# EAGLE design BPF (EAGLE 9.6.2)
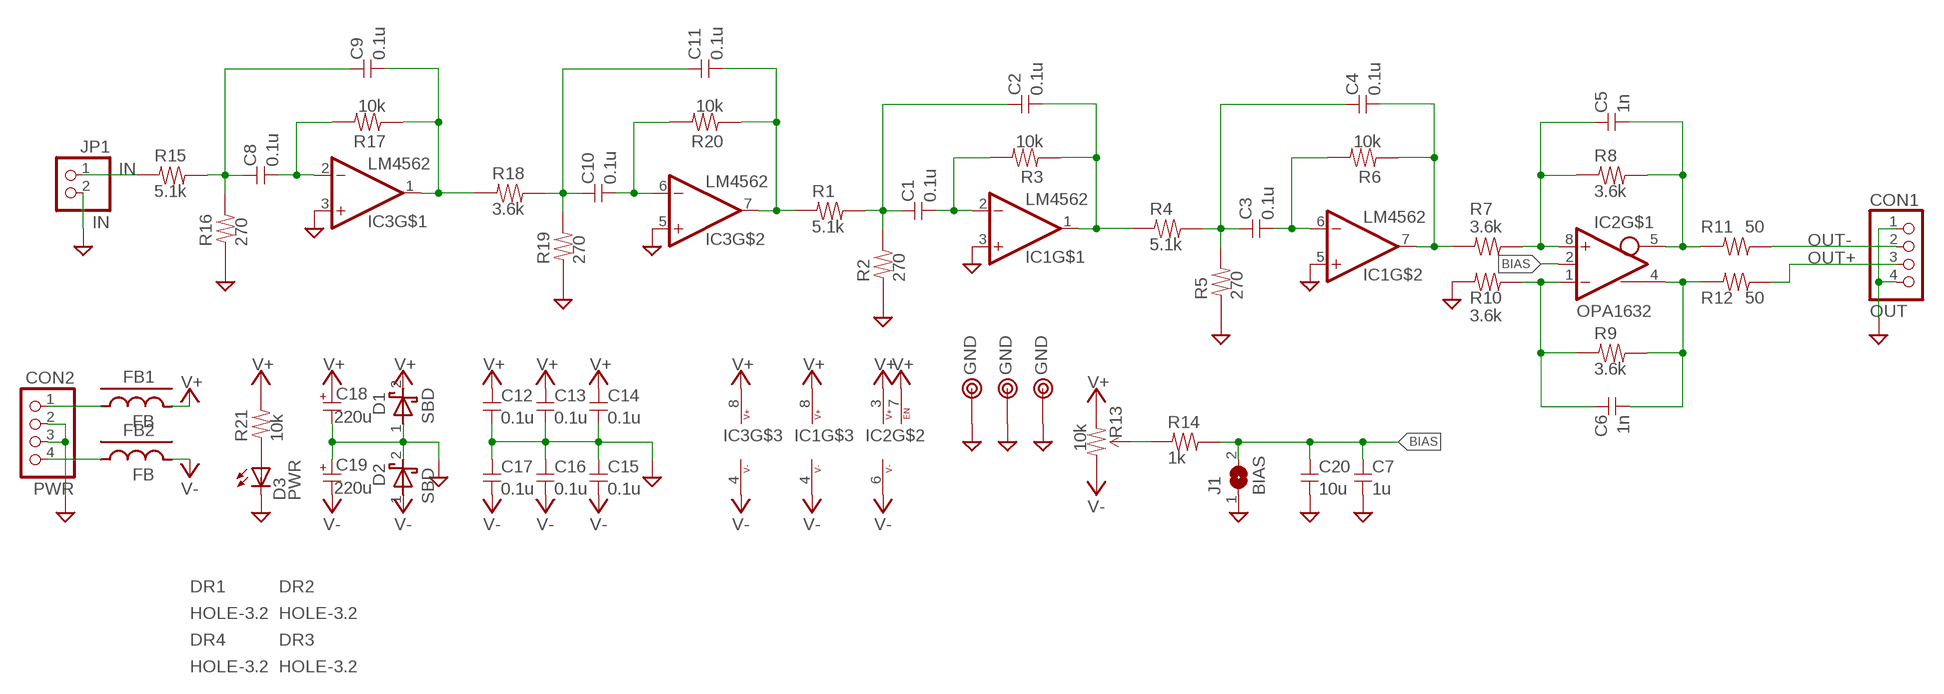
[diagram p0: schematic, sheet 1]

## Parts
C1  0.1u  C-5W  [C050W]
C2  0.1u  C-5W  [C050W]
C3  0.1u  C-5W  [C050W]
C4  0.1u  C-5W  [C050W]
C5  1n  C-2012  [2012]
C6  1n  C-2012  [2012]
C7  1u  C-1608  [1608C]
C8  0.1u  C-5W  [C050W]
C9  0.1u  C-5W  [C050W]
C10  0.1u  C-5W  [C050W]
C11  0.1u  C-5W  [C050W]
C12  0.1u  C-1608  [1608C]
C13  0.1u  C-1608  [1608C]
C14  0.1u  C-1608  [1608C]
C15  0.1u  C-1608  [1608C]
C16  0.1u  C-1608  [1608C]
C17  0.1u  C-1608  [1608C]
C18  220u  CPOLE2.5-8  [E2,5-8]
C19  220u  CPOLE2.5-8  [E2,5-8]
C20  10u  C-3216  [3216]
CON1  OUT  PINHD-1X4-N  [1X04]
CON2  PWR  PINHD-1X4-N  [1X04]
D1  SBD  SBD-1A2  [SOD123]
D2  SBD  SBD-1A2  [SOD123]
D3  PWR  LED-SMD1608  [D1608]
DR1  HOLE-3.2  [HOLE_3.2]
DR2  HOLE-3.2  [HOLE_3.2]
DR3  HOLE-3.2  [HOLE_3.2]
DR4  HOLE-3.2  [HOLE_3.2]
FB1  FB  FB-2012-FB  [2012-R]
FB2  FB  FB-2012-FB  [2012-R]
IC1  LM4562  OPA-2-SOP  [SOP8]
IC2  OPA1632  OPA-DIFF  [SOP8]
IC3  LM4562  OPA-2-SOP  [SOP8]
J1  BIAS  SJ-1608  [1608-J]
JP1  IN  PINHD-1X2  [1X02]
R1  5.1k  R-2012  [2012]
R2  270  R-2012  [2012]
R3  10k  R-2012  [2012]
R4  5.1k  R-2012  [2012]
R5  270  R-2012  [2012]
R6  10k  R-2012  [2012]
R7  3.6k  R-2012  [2012]
R8  3.6k  R-2012  [2012]
R9  3.6k  R-2012  [2012]
R10  3.6k  R-2012  [2012]
R11  50  R-1608  [1608]
R12  50  R-1608  [1608]
R13  10k  R-VAL-3296W  [3296W]
R14  1k  R-1608  [1608]
R15  5.1k  R-2012  [2012]
R16  270  R-2012  [2012]
R17  10k  R-2012  [2012]
R18  3.6k  R-2012  [2012]
R19  270  R-2012  [2012]
R20  10k  R-2012  [2012]
R21  10k  R-1608  [1608]
TP1  GND  TESTPIN  [TESTPIN]
TP2  GND  TESTPIN  [TESTPIN]
TP3  GND  TESTPIN  [TESTPIN]

## Nets
BIAS: C7.1 C20.1 IC2.2(CM) J1.2 R14.2
GND: C7.2 C12.2 C13.2 C14.2 C15.1 C16.1 C17.1 C18.- C19.+ C20.2 CON1.1 CON1.4 CON2.2 CON2.3 D1.1(A) D2.2(K) D3.K IC1.3(+IN) IC1.5(+IN) IC3.3(+IN) IC3.5(+IN) J1.1 JP1.2 R2.1 R5.1 R10.1 R16.1 R19.1 TP1.1 TP2.1 TP3.1
IN: JP1.1 R15.1
N$1: C1.1 C1.3 C2.1 C2.3 R1.2 R2.2
N$2: C1.2 C1.4 IC1.2(-IN) R3.2
N$3: C2.2 C2.4 IC1.1(OUT) R3.1 R4.1
N$4: C4.2 C4.4 IC1.7(OUT) R6.1 R7.1
N$5: C3.1 C3.3 C4.1 C4.3 R4.2 R5.2
N$6: C3.2 C3.4 IC1.6(-IN) R6.2
N$7: CON2.1 FB1.1
N$8: C5.1 IC2.8(+IN) R7.2 R8.1
N$9: C6.1 IC2.1(-IN) R9.1 R10.2
N$10: C8.1 C8.3 C9.1 C9.3 R15.2 R16.2
N$11: C5.2 IC2.5(-OUT) R8.2 R11.1
N$12: C6.2 IC2.4(+OUT) R9.2 R12.1
N$13: C8.2 C8.4 IC3.2(-IN) R17.2
N$14: R13.2 R14.1
N$15: C9.2 C9.4 IC3.1(OUT) R17.1 R18.1
N$16: C11.2 C11.4 IC3.7(OUT) R1.1 R20.1
N$17: C10.1 C10.3 C11.1 C11.3 R18.2 R19.2
N$18: C10.2 C10.4 IC3.6(-IN) R20.2
N$19: CON2.4 FB2.1
N$20: D3.A R21.1
OUT+: CON1.3 R12.2
OUT-: CON1.2 R11.2
V+: C12.1 C13.1 C14.1 C18.+ D1.2(K) FB1.2 IC1.8(V+) IC2.3(V+) IC2.7(EN) IC3.8(V+) R13.1 R21.2
V-: C15.2 C16.2 C17.2 C19.- D2.1(A) FB2.2 IC1.4(V-) IC2.6(V-) IC3.4(V-) R13.3

## Library data of the parts
C1-C17 C20 = my_rcl:C
C18 C19 = my_rcl:CPOL
CON1 CON2 = my_connector:PINHD-1X4
D1 D2 = my_rcl:SBD
D3 = my_rcl:LED
DR1-DR4 = my_connector:HOLE-3.2
FB1 FB2 = my_rcl:FB
IC1 IC3 = my_ic:OPA-2
IC2 = my_ic:OPA-DIFF
J1 = my_rcl:SJ
JP1 = my_connector:PINHD-1X2
R1-R12 R14-R21 = my_rcl:R
R13 = my_rcl:R-VAL
TP1-TP3 = my_connector:TESTPIN

## Board
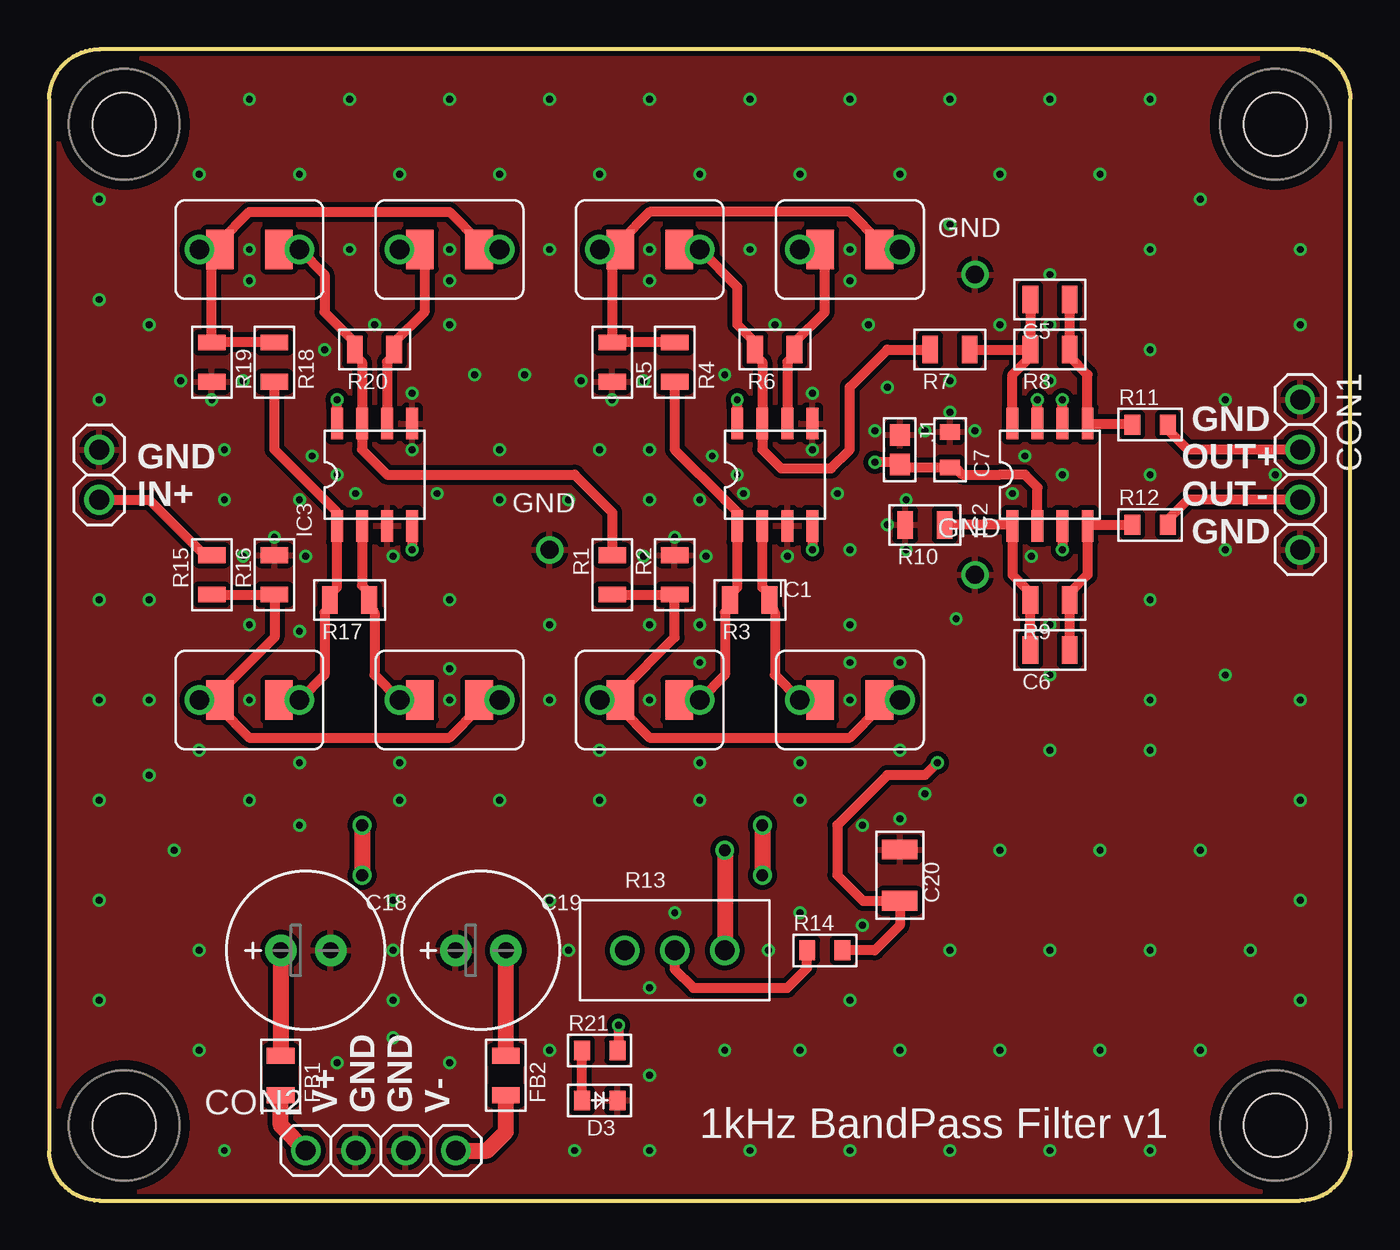
[diagram p1: board, top side]
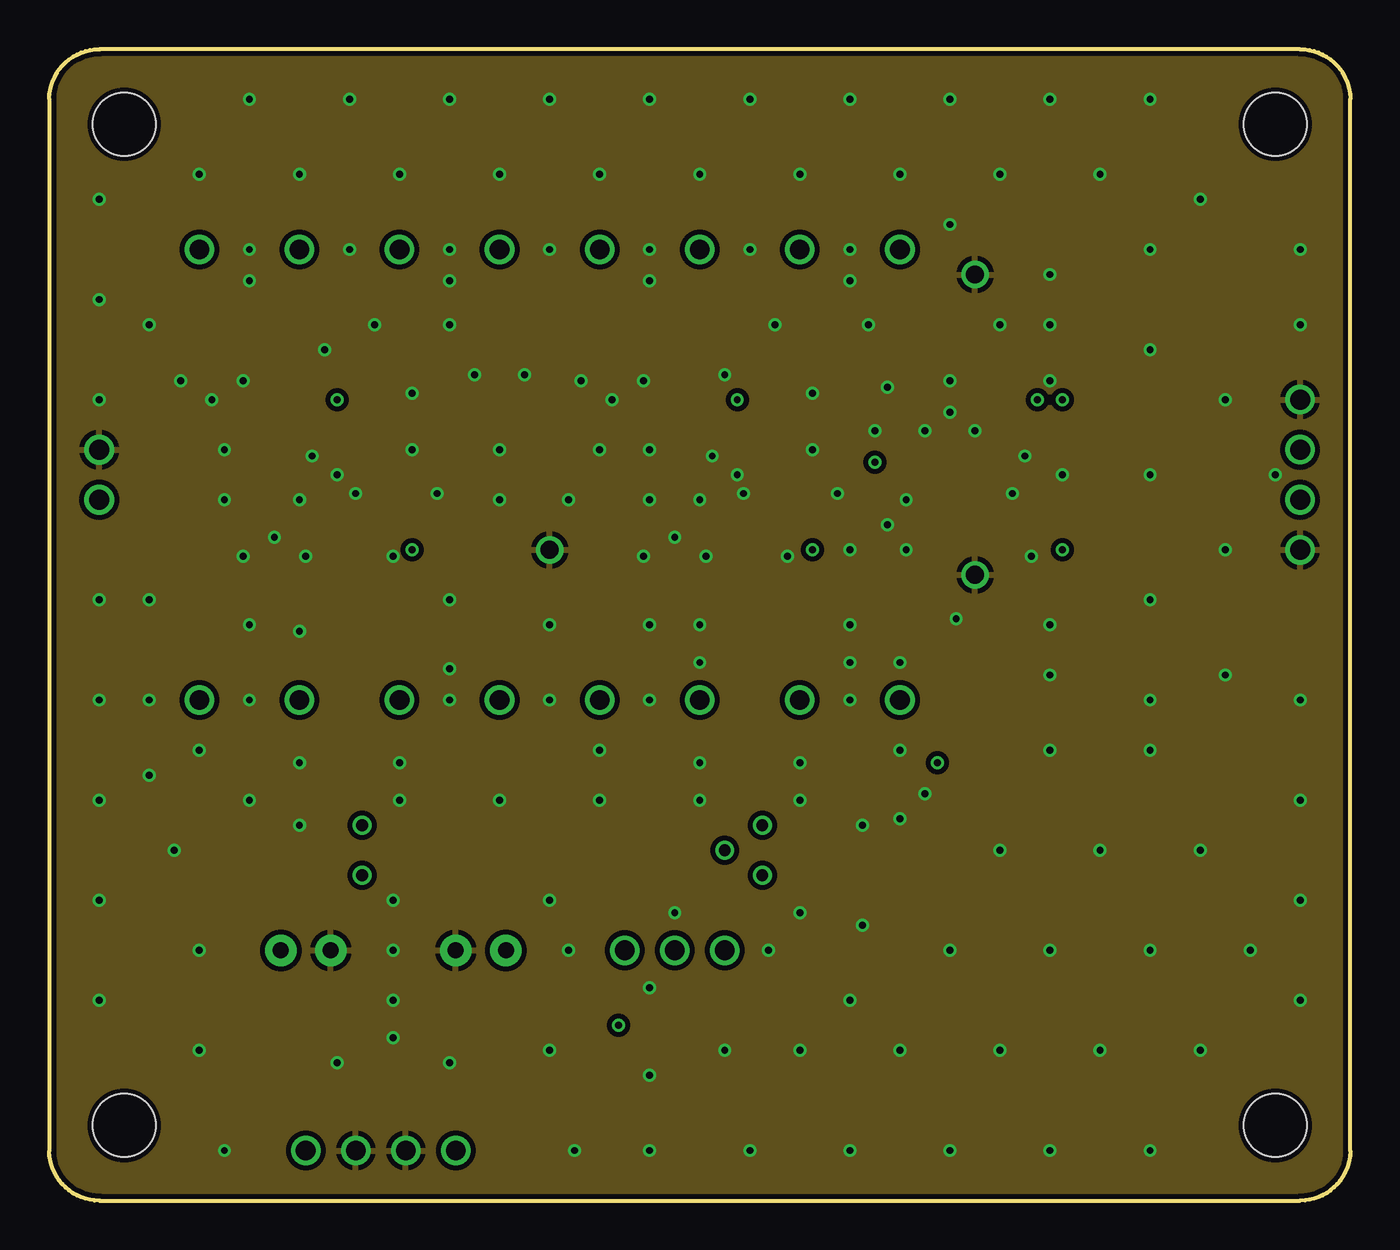
[diagram p2: board, inner layer Route2]
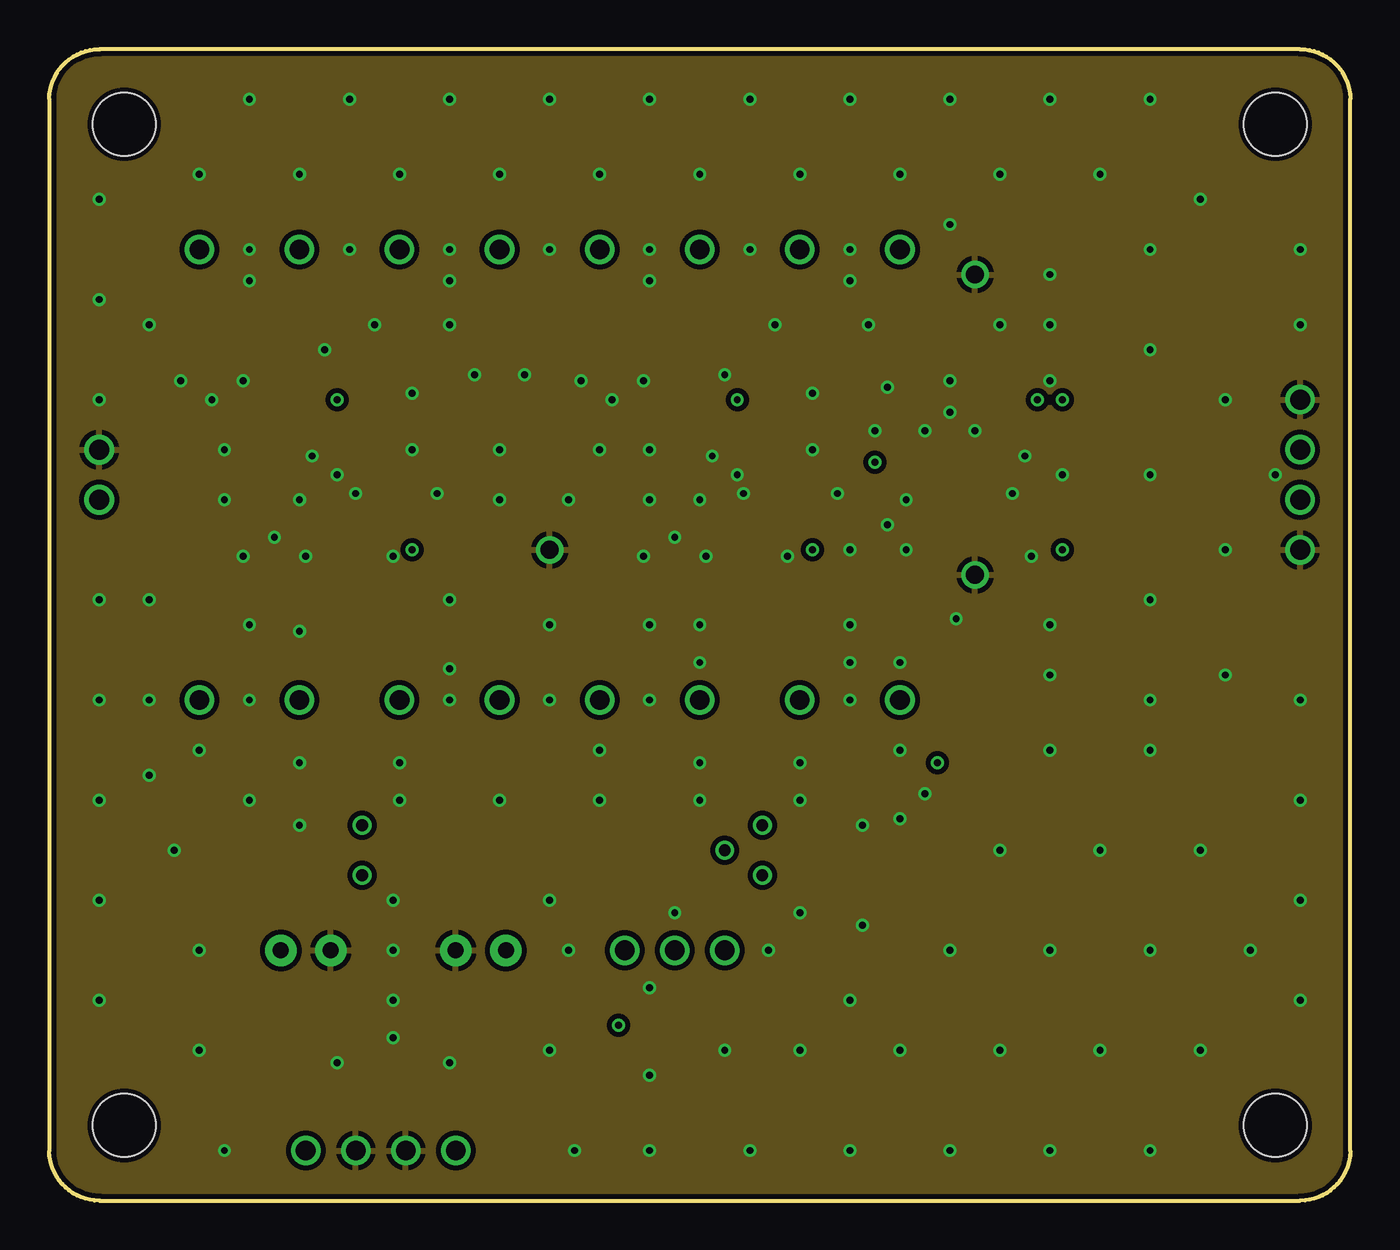
[diagram p3: board, inner layer Route15]
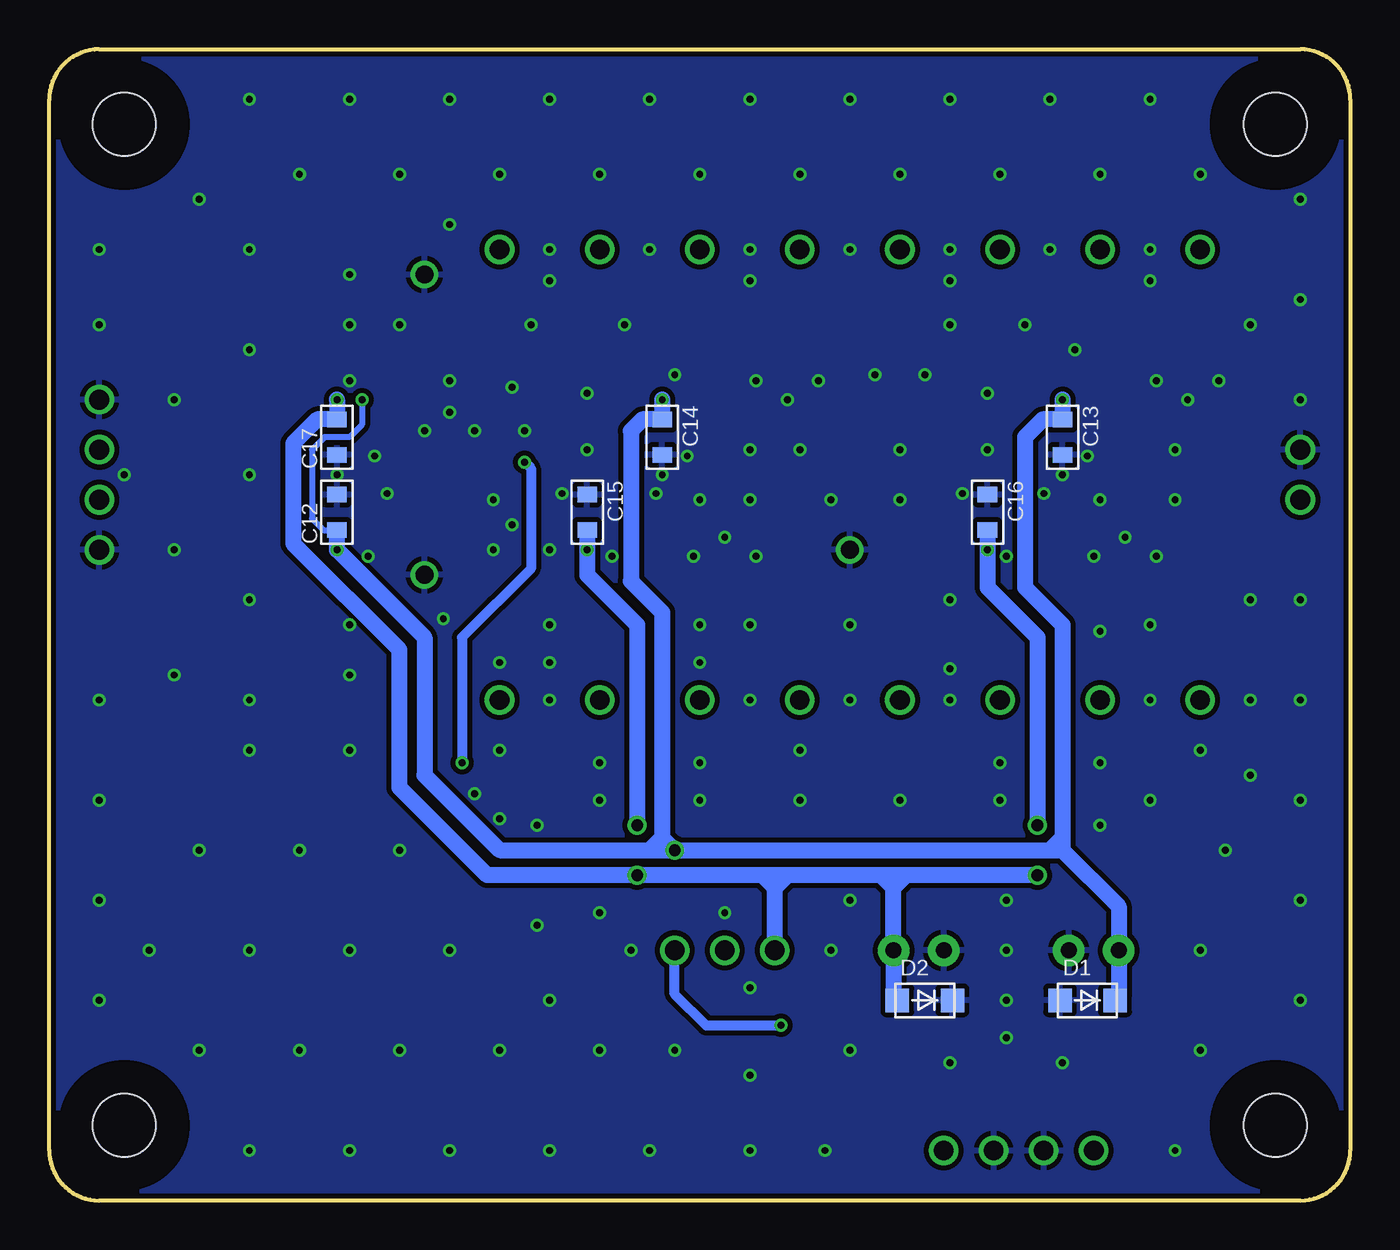
[diagram p4: board, bottom side, seen from below]

Size 66.04 x 58.42 mm. Coordinates in mm from the lower left corner, seen from the top.
Outline: 2.54,0 63.5,0 arc90 66.04,2.54 66.04,55.88 arc90 63.5,58.42 2.54,58.42 arc90 0,55.88 0,2.54 arc90 2.54,0
Copper layers (1*2*15*16): Top 0.035mm / dielectric 0.2mm / Route2 0.0175mm / dielectric 1.065mm / Route15 0.0175mm / dielectric 0.2mm / Bottom 0.035mm
Design rules "JLCPCB_4layer": minimum track width 6mil, minimum drill 0.3mm, track to track 6mil, track to pad 6mil, pad to pad 6mil, via to via 8mil, smd to smd 0mil, copper to edge 0.2mm, drill to drill 0.4mm, minimum pad ring 8mil, minimum via ring 6mil, stop-mask expansion 4mil, vias tented up to drill 1mm, thermal gap 10mil

### Footprints (pad centres in the part's own frame; a part is rotated, then mirrored left to right if it is on the bottom)
C050W = drill 1: 1 -2.54,0; 2 2.54,0 | smd 1.4 x 2: 3 -1.5,0; 4 1.5,0
2012 = smd 0.8 x 1.4: 1 -1,0; 2 1,0
1608C = smd 0.8 x 1: 1 -0.9,0; 2 0.9,0
E2,5-8 = drill 0.813 pad 1.6: + -1.27,0; - 1.27,0
3216 = smd 1 x 1.8: 1 -1.3,0; 2 1.3,0
1X04 = drill 1: 1 -3.81,0; 2 -1.27,0; 3 1.27,0; 4 3.81,0
SOD123 = smd 1.2 x 1.2: 1 -1.4,0; 2 1.4,0
D1608 = smd 0.8 x 1: A 0.9,0; K -0.9,0
HOLE_3.2 = hole 3.2: 0,0
2012-R = smd 0.8 x 1.4: 1 -1,0; 2 1,0
SOP8 = smd 0.6 x 1.6: 1 -1.905,-2.6; 2 -0.635,-2.6; 3 0.635,-2.6; 4 1.905,-2.6; 5 1.905,2.6; 6 0.635,2.6; 7 -0.635,2.6; 8 -1.905,2.6
1608-J = smd 1.1 x 1: 1 -0.75,0; 2 0.75,0
1X02 = drill 1.016: 1 -1.27,0; 2 1.27,0
1608 = smd 0.8 x 1: 1 -0.9,0; 2 0.9,0
3296W = drill 1: 1 2.54,0; 2 0,0; 3 -2.54,0
TESTPIN = drill 0.9 pad 1.4: 1 0,0

### Placement (x,y rotation side)
C1  40.64,25.4 180 top
C2  30.48,25.4 0 top
C3  40.64,48.26 180 top
C4  30.48,48.26 0 top
C5  50.8,45.72 0 top
C6  50.8,27.94 0 top
C7  45.72,38.1 90 top
C8  20.32,25.4 180 top
C9  10.16,25.4 0 top
C10  20.32,48.26 180 top
C11  10.16,48.26 0 top
C12  51.44,34.93 90 bottom
C13  14.61,38.73 270 bottom
C14  34.92,38.73 270 bottom
C15  38.73,34.93 270 bottom
C16  18.41,34.93 270 bottom
C17  51.44,38.73 90 bottom
C18  13.02,12.7 0 top
C19  21.91,12.7 0 top
C20  43.18,16.51 90 top
CON1  63.5,36.83 270 top
CON2  16.83,2.54 0 top
D1  13.34,10.16 0 bottom
D2  21.59,10.16 0 bottom
D3  27.94,5.08 180 top
DR1  3.81,3.81 0 top
DR2  3.81,54.61 0 top
DR3  62.23,3.81 0 top
DR4  62.23,54.61 0 top
FB1  11.75,6.35 90 top
FB2  23.18,6.35 90 top
IC1  36.83,36.83 0 top
IC2  50.8,36.83 0 top
IC3  16.51,36.83 0 top
J1  43.18,38.1 270 top
JP1  2.54,36.83 90 top
R1  28.58,31.75 270 top
R2  31.75,31.75 270 top
R3  35.56,30.48 0 top
R4  31.75,42.55 90 top
R5  28.58,42.55 90 top
R6  36.83,43.18 0 top
R7  45.72,43.18 0 top
R8  50.8,43.18 0 top
R9  50.8,30.48 0 top
R10  44.45,34.29 0 top
R11  55.88,39.37 0 top
R12  55.88,34.29 0 top
R13  31.75,12.7 0 top
R14  39.37,12.7 0 top
R15  8.26,31.75 270 top
R16  11.43,31.75 270 top
R17  15.24,30.48 0 top
R18  11.43,42.55 90 top
R19  8.26,42.55 90 top
R20  16.51,43.18 0 top
R21  27.94,7.62 0 top
TP1  25.4,33.02 0 top
TP2  46.99,46.99 0 top
TP3  46.99,31.75 0 top

### Tracks (layer width: path | path; a pad name or v marks a point on that pad's centre or on a via)
BIAS  (via drill 0.35)
  Top 0.508: IC2.2 50.16,36.2 49.53,36.83 48.26,36.83 46.36,36.83 45.98,37.2 C7.1 43.33,37.2 J1.2 43.06,37.47 v41.91,37.47 | v45.09,22.23 44.45,21.59 42.55,21.59 40,19.05 40,16.51 41.3,15.21 C20.1 43.18,13.97 41.91,12.7 R14.2
  Bottom 0.508: v41.91,37.47 41.59,37.15 41.59,32.07 45.09,28.58 v45.09,22.23
GND  (via drill 0.35)
  other vias: 14.61,36.83 18.41,38.1 18.41,40.96 17.46,32.7 19.68,35.88 40,35.88 37.47,32.7 38.73,40.96 38.73,38.1 35.24,35.88 43.5,35.56 43.5,33.02 40.64,33.02 40.64,29.21 43.18,22.86 43.18,19.37 41.27,19.05 38.1,20.32 33.02,20.32 27.94,20.32 22.86,20.32 17.78,20.32 25.4,25.4 20.32,30.48 2.54,50.8 2.54,45.72 2.54,40.64 2.54,30.48 2.54,25.4 2.54,20.32 2.54,15.24 2.54,10.16 7.62,7.62 8.89,2.54 26.67,2.54 30.48,2.54 35.56,2.54 40.64,2.54 45.72,2.54 50.8,2.54 55.88,2.54 58.42,7.62 63.5,10.16 63.5,15.24 63.5,20.32 63.5,25.4 63.5,44.45 63.5,48.26 58.42,50.8 55.88,55.88 50.8,55.88 45.72,55.88 40.64,55.88 35.56,55.88 30.48,55.88 25.4,55.88 20.32,55.88 15.24,55.88 10.16,55.88 7.62,52.07 9.84,41.59 8.26,40.64 6.67,41.59 9.84,32.7 13.02,32.7 11.43,33.66 30.16,32.7 33.34,32.7 31.75,33.66 26.99,41.59 30.16,41.59 28.58,40.64 42.55,34.29 46.04,29.53 43.18,27.3 33.66,37.78 13.34,37.78 15.56,35.88 34.92,36.83 22.86,38.1 27.94,38.1 22.86,35.56 26.35,35.56 30.48,35.56 41.91,39.05 44.45,39.05 46.99,39.05 45.72,40.01 50.8,41.59 50.8,44.45 50.8,46.99 50.8,29.21 50.8,26.67 49.85,32.7 59.69,33.02 59.69,40.64 55.88,36.83 62.23,36.83 55.88,30.48 55.88,43.18 55.88,25.4 55.88,48.26 50.8,22.86 48.26,17.78 38.1,14.61 31.75,14.61 25.4,15.24 30.48,6.35 25.4,7.62 38.1,7.62 43.18,7.62 48.26,7.62 53.34,7.62 45.72,12.7 50.8,12.7 55.88,12.7 60.96,12.7 53.34,17.78 58.42,17.78 55.88,22.86 59.69,26.67 7.62,12.7 6.35,17.78 10.16,20.32 12.7,19.05 5.08,25.4 5.08,21.59 5.08,30.48 8.89,35.56 5.08,44.45 13.97,43.18 8.89,38.1 10.16,46.67 15.24,48.26 16.51,44.45 12.7,52.07 17.78,52.07 22.86,52.07 27.94,52.07 33.02,52.07 38.1,52.07 43.18,52.07 48.26,52.07 53.34,52.07 45.72,49.53 41.59,44.45 40.64,46.67 30.48,46.67 20.32,46.67 20.32,26.99 40.64,25.4 30.48,25.4 20.32,25.4 10.16,25.4 40.64,27.3 33.02,27.3 10.16,48.26 20.32,48.26 30.48,48.26 40.64,48.26 25.4,48.26 30.48,38.1 33.02,35.56 12.7,35.56 48.89,35.88 51.44,36.83 49.53,37.78 34.29,41.91 25.4,29.21 24.13,41.91 10.16,29.21 30.48,29.21 12.7,28.89 33.02,29.21 17.46,15.24 17.46,12.7 41.27,13.97 20.32,44.45 21.59,41.91 35.56,48.26 36.83,44.45 45.72,41.59 42.55,41.28 48.26,44.45 36.51,12.7 40.64,10.16 44.45,20.64 26.35,12.7 12.7,22.23 17.78,22.23 33.02,22.23 38.1,22.23 27.94,22.86 7.62,22.86 17.46,10.16 17.46,8.26 20.32,6.99 14.61,6.99 30.48,10.8 34.29,7.62
  pour Top (isolate 0.254): 0,0 0,58.42 66.04,58.42 66.04,0
  pour Bottom (isolate 0.254): 0,58.42 66.04,58.42 66.04,0 0,0
  pour Route2 (isolate 0.254): 0,58.42 0,0 66.04,0 66.04,58.42
  pour Route15 (isolate 0.254): 0,58.42 0,0 66.04,0 66.04,58.42
IN
  Top 0.508: JP1.1 5.08,35.56 7.89,32.75 R15.1
N$1
  Top 0.508: R1.2 R2.2 31.75,28.58 28.98,25.8 C2.3 | C2.1 C2.3 | C2.3 28.98,25 30.48,23.5 40.64,23.5 42.14,25 C1.3 C1.1
N$2
  Top 0.508: C1.4 C1.2 36.83,26.67 36.83,29.85 36.56,30.12 R3.2 36.56,30.75 36.2,31.12 IC1.2
N$3
  Top 0.508: C2.4 C2.2 34.29,26.67 34.29,29.85 34.56,30.12 R3.1 34.56,30.75 34.92,31.12 IC1.1 34.92,34.93 34.29,35.56 31.75,38.1 R4.1
N$4
  Top 0.508: C4.4 C4.2 34.92,46.36 34.92,44.45 35.83,43.55 R6.1 35.83,42.91 36.2,42.55 IC1.7 36.2,38.1 37.15,37.15 39.69,37.15 40.64,38.1 40.64,41.28 42.55,43.18 R7.1
N$5
  Top 0.508: C3.1 C3.3 42.14,48.67 40.64,50.17 30.48,50.17 28.98,48.67 C4.3 | C4.1 C4.3 | R4.2 R5.2 28.58,47.86 C4.3 | C4.3 29.21,48.03 C4.3
N$6
  Top 0.508: 39.25,48.14 39.37,48.03 39.37,45.09 37.83,43.55 R6.2 37.83,42.91 37.47,42.55 IC1.6 | 39.25,48.14 C3.4 | C3.2 C3.4 | C3.4 39.25,48.14
N$7
  Top 0.813: CON2.1 11.75,3.81 FB1.1
N$8
  Top 0.508: C5.1 R8.1 | IC2.8 48.89,41.91 49.8,42.81 R8.1 | R7.2 R8.1
N$9
  Top 0.508: C6.1 R9.1 49.8,30.85 48.89,31.75 IC2.1 48.84,34.29 R10.2
N$10
  Top 0.508: C9.1 C9.3 | C9.3 8.66,25 10.16,23.5 20.32,23.5 21.82,25 C8.3 C8.1 | R16.2 11.43,30.48 | 11.43,30.48 11.43,28.58 8.66,25.8 C9.3 | R15.2 11.16,30.75 11.43,30.48
N$11
  Top 0.508: C5.2 R8.2 51.8,42.81 52.7,41.91 IC2.5 54.92,39.43 R11.1
N$12
  Top 0.508: C6.2 R9.2 51.8,30.85 52.7,31.75 IC2.4 52.77,34.29 R12.1
N$13
  Top 0.508: C8.4 C8.2 16.51,26.67 16.51,29.85 16.24,30.12 R17.2 16.24,30.85 15.88,31.21 IC3.2
N$14
  Top 0.508: R13.2 31.75,11.75 32.7,10.8 37.47,10.8 38.47,11.8 R14.1
N$15
  Top 0.508: R18.1 11.43,38.1 14.61,34.93 IC3.1 14.61,31.12 14.24,30.75 R17.1 14.24,30.12 13.97,29.85 13.97,26.67 C9.2 C9.4
N$16
  Top 0.508: C11.4 C11.2 13.97,46.99 13.97,45.09 15.51,43.55 R20.1 15.51,42.91 15.88,42.55 IC3.7 15.88,38.1 17.14,36.83 26.67,36.83 28.58,34.93 R1.1
N$17
  Top 0.508: R18.2 R19.2 8.26,47.86 C11.3 | C11.1 C11.3 | C11.3 8.66,48.67 10.16,50.17 20.32,50.17 21.82,48.67 C10.3 C10.1
N$18
  Top 0.508: C10.4 19.05,48.03 | 19.05,48.03 19.05,45.09 17.51,43.55 R20.2 17.51,42.91 17.14,42.55 IC3.6 | C10.2 C10.4 | C10.4 19.05,48.03
N$19
  Top 0.813: CON2.4 22.23,2.54 23.18,3.49 FB2.1
N$20
  Top 0.508: D3.A R21.1
OUT+
  Top 0.508: CON1.3 57.79,35.56 56.78,34.55 R12.2
OUT-
  Top 0.508: CON1.2 57.79,38.1 56.78,39.11 R11.2
V+  (via drill 0.35, 0.6)
  Top 0.508: IC2.7 v50.16,40.64 | IC2.3 v51.44,33.02 | IC3.8 v14.61,40.64 | IC1.8 v34.92,40.64 | v28.89,8.89 28.89,7.67 R21.2
  Top 0.813: v34.29,17.78 R13.1 | C18.+ FB1.2
  Bottom 0.305: v50.16,40.64 50.16,39.37 50.8,38.73 52.07,38.73 52.7,38.1 52.7,34.61 52.12,34.02 C12.1
  Bottom 0.508: v28.89,8.89 32.7,8.89 34.29,10.48 R13.1
  Bottom 0.813: v14.61,40.64 C13.1 15.61,39.64 16.51,38.73 16.51,31.12 14.61,29.21 14.61,18.41 | v34.92,40.64 C14.1 35.93,39.64 36.51,39.05 36.51,31.43 34.92,29.85 34.92,18.41 | C12.1 v51.44,33.02 46.99,28.58 46.99,21.59 43.18,17.78 35.56,17.78 | 14.61,17.78 11.75,14.92 C18.+ 11.75,10.35 D1.2 | 35.56,17.78 34.92,17.78 | 34.92,17.78 v34.29,17.78 | v34.29,17.78 15.24,17.78 | 15.24,17.78 14.61,17.78 | 14.61,18.41 14.61,17.78 | 34.92,17.78 34.92,18.41 | 34.92,18.41 v34.29,17.78 | 34.92,18.41 35.56,17.78 | 14.61,18.41 15.24,17.78
V-  (via drill 0.35, 0.6)
  Top 0.508: IC1.4 v38.73,33.02 | IC2.6 v51.44,40.64 | IC3.4 v18.41,33.02
  Top 0.813: v15.88,19.05 v15.88,16.51 | v36.2,19.05 v36.2,16.51 | FB2.2 C19.-
  Bottom 0.813: C16.2 v18.41,33.02 18.41,31.12 15.88,28.58 v15.88,19.05 | C15.2 v38.73,33.02 38.73,31.75 36.2,29.21 v36.2,19.05 | v51.44,40.64 C17.2 52.44,39.64 53.66,38.42 53.66,33.34 48.26,27.94 48.26,20.96 43.81,16.51 v36.2,16.51 29.84,16.51 | 23.18,15.88 23.18,16.51 | 23.18,15.88 C19.- 23.18,10.35 D2.1 | 22.54,16.51 20.32,16.51 v15.88,16.51 | 22.54,16.51 23.18,16.51 | 28.58,16.51 29.53,16.51 29.84,16.51 | R13.3 29.21,15.88 | 28.58,16.51 29.21,15.88 | 29.21,15.88 29.84,16.51 | 23.18,15.88 23.81,16.51 | 23.18,15.88 22.54,16.51 | 23.18,16.51 23.81,16.51 | 23.81,16.51 28.58,16.51

### Text on the board
tPlace: GND / IN+ | GND / OUT+ / OUT- / GND | V+ / GND / GND / V- | 1kHz BandPass Filter v1